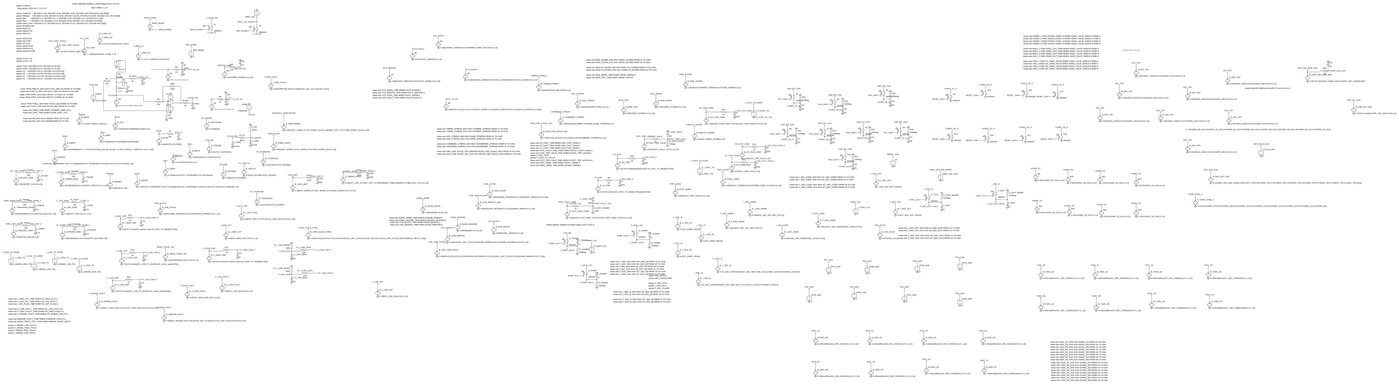
[diagram p0: schematic Draft11.asc, whole sheet]
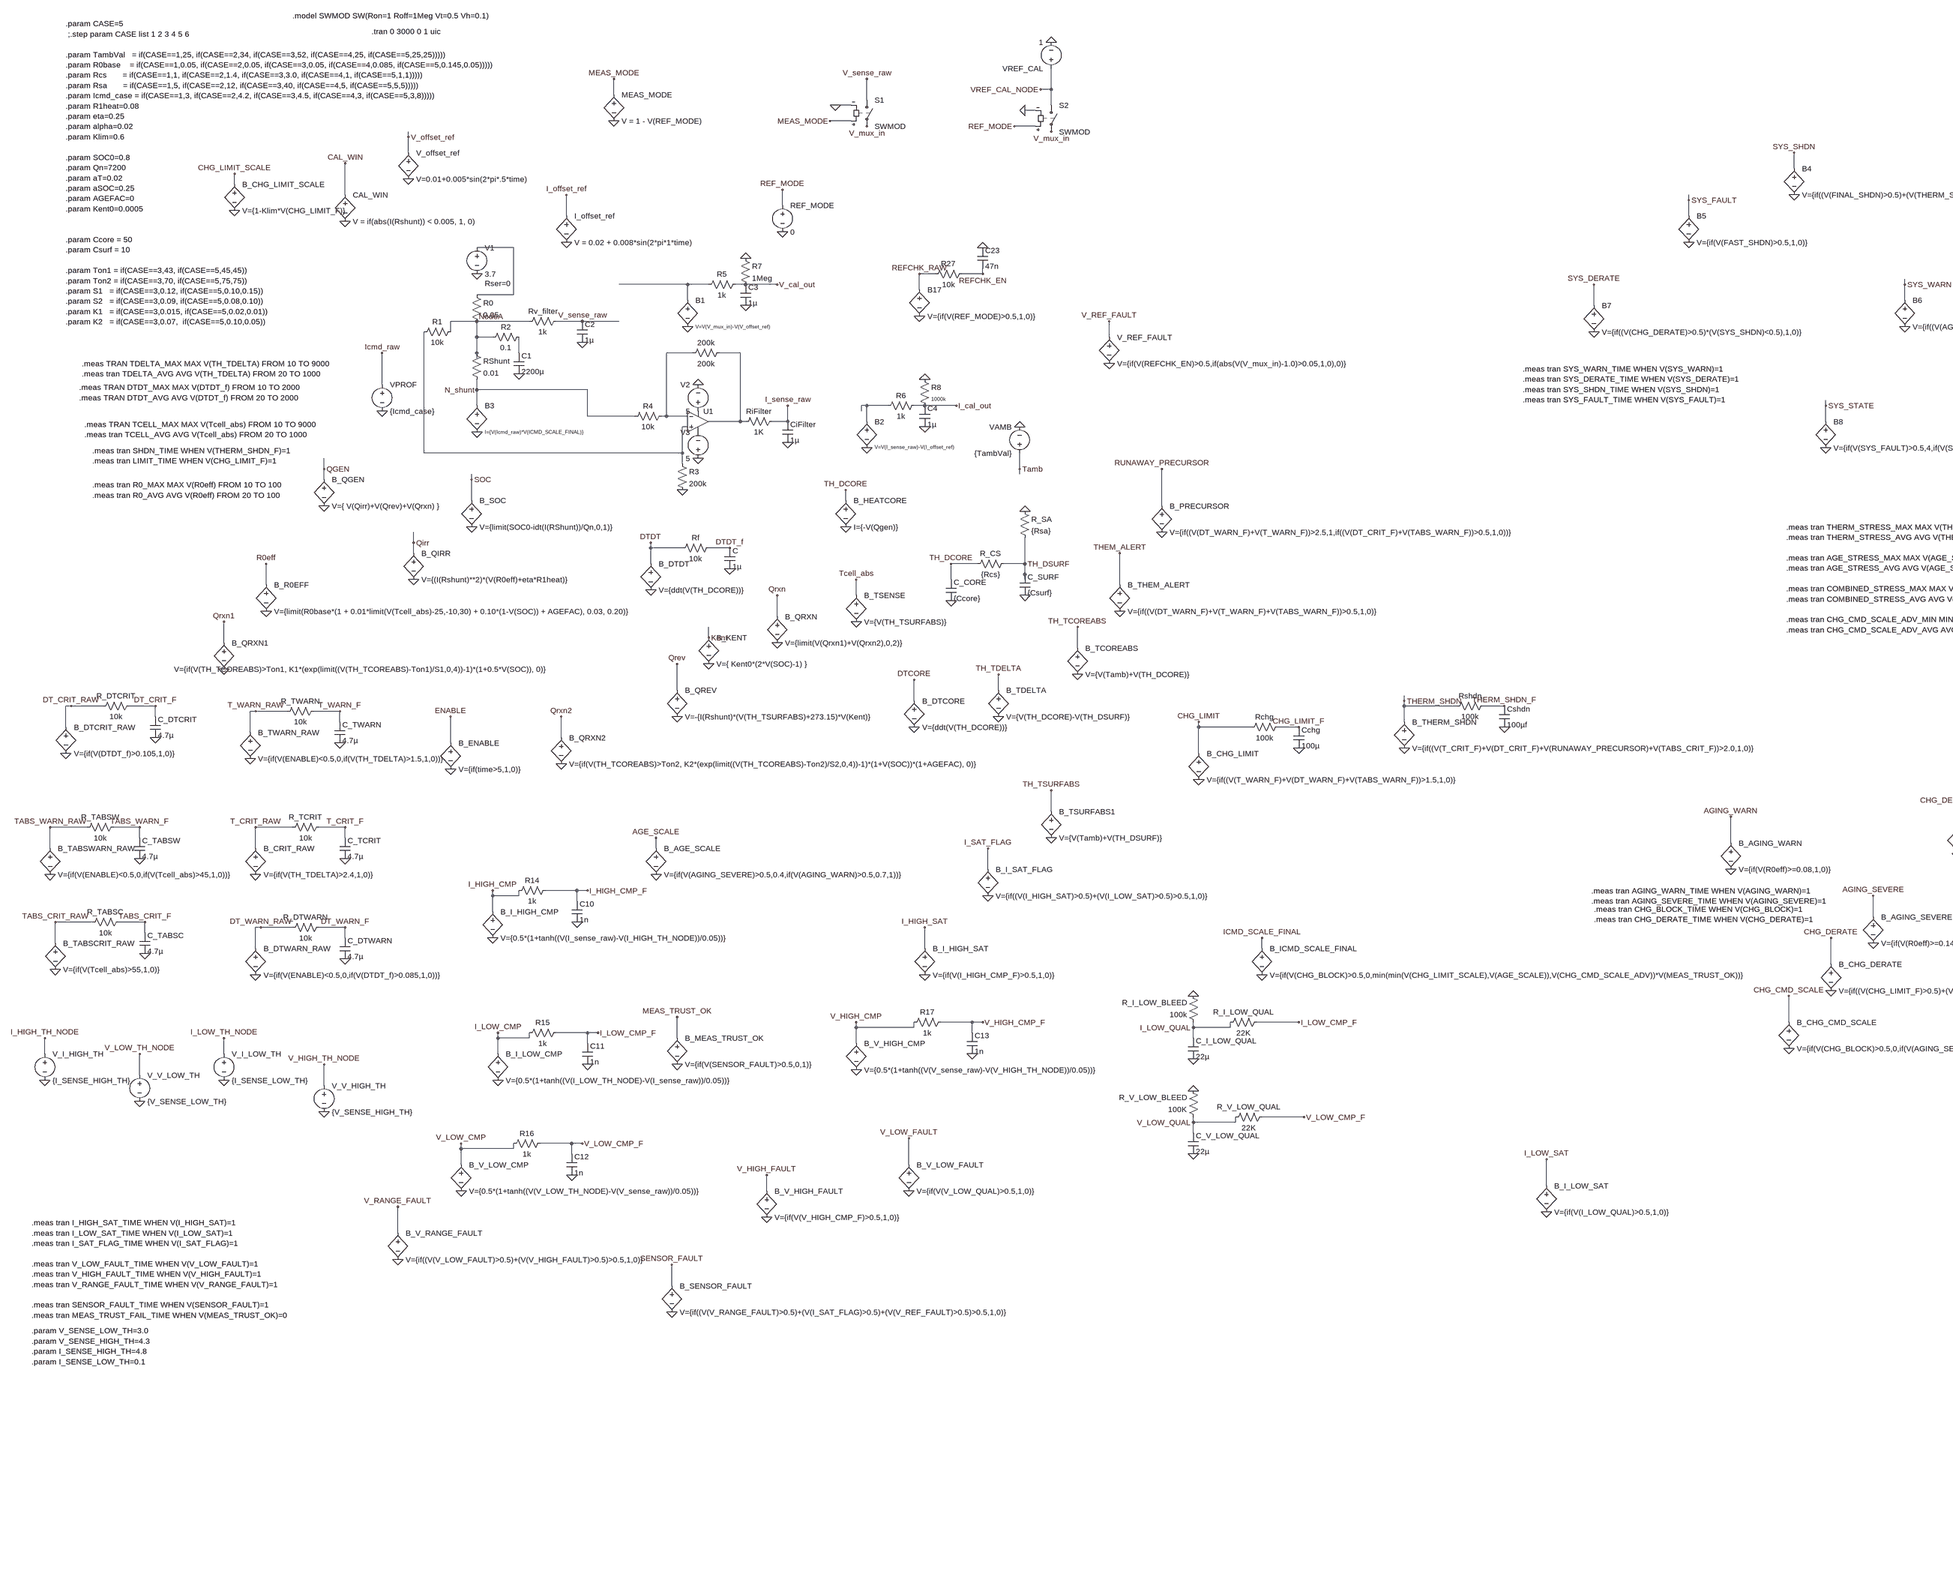
[diagram p1: schematic Draft11.asc, part, row 1 of 1, column 1 of 3]
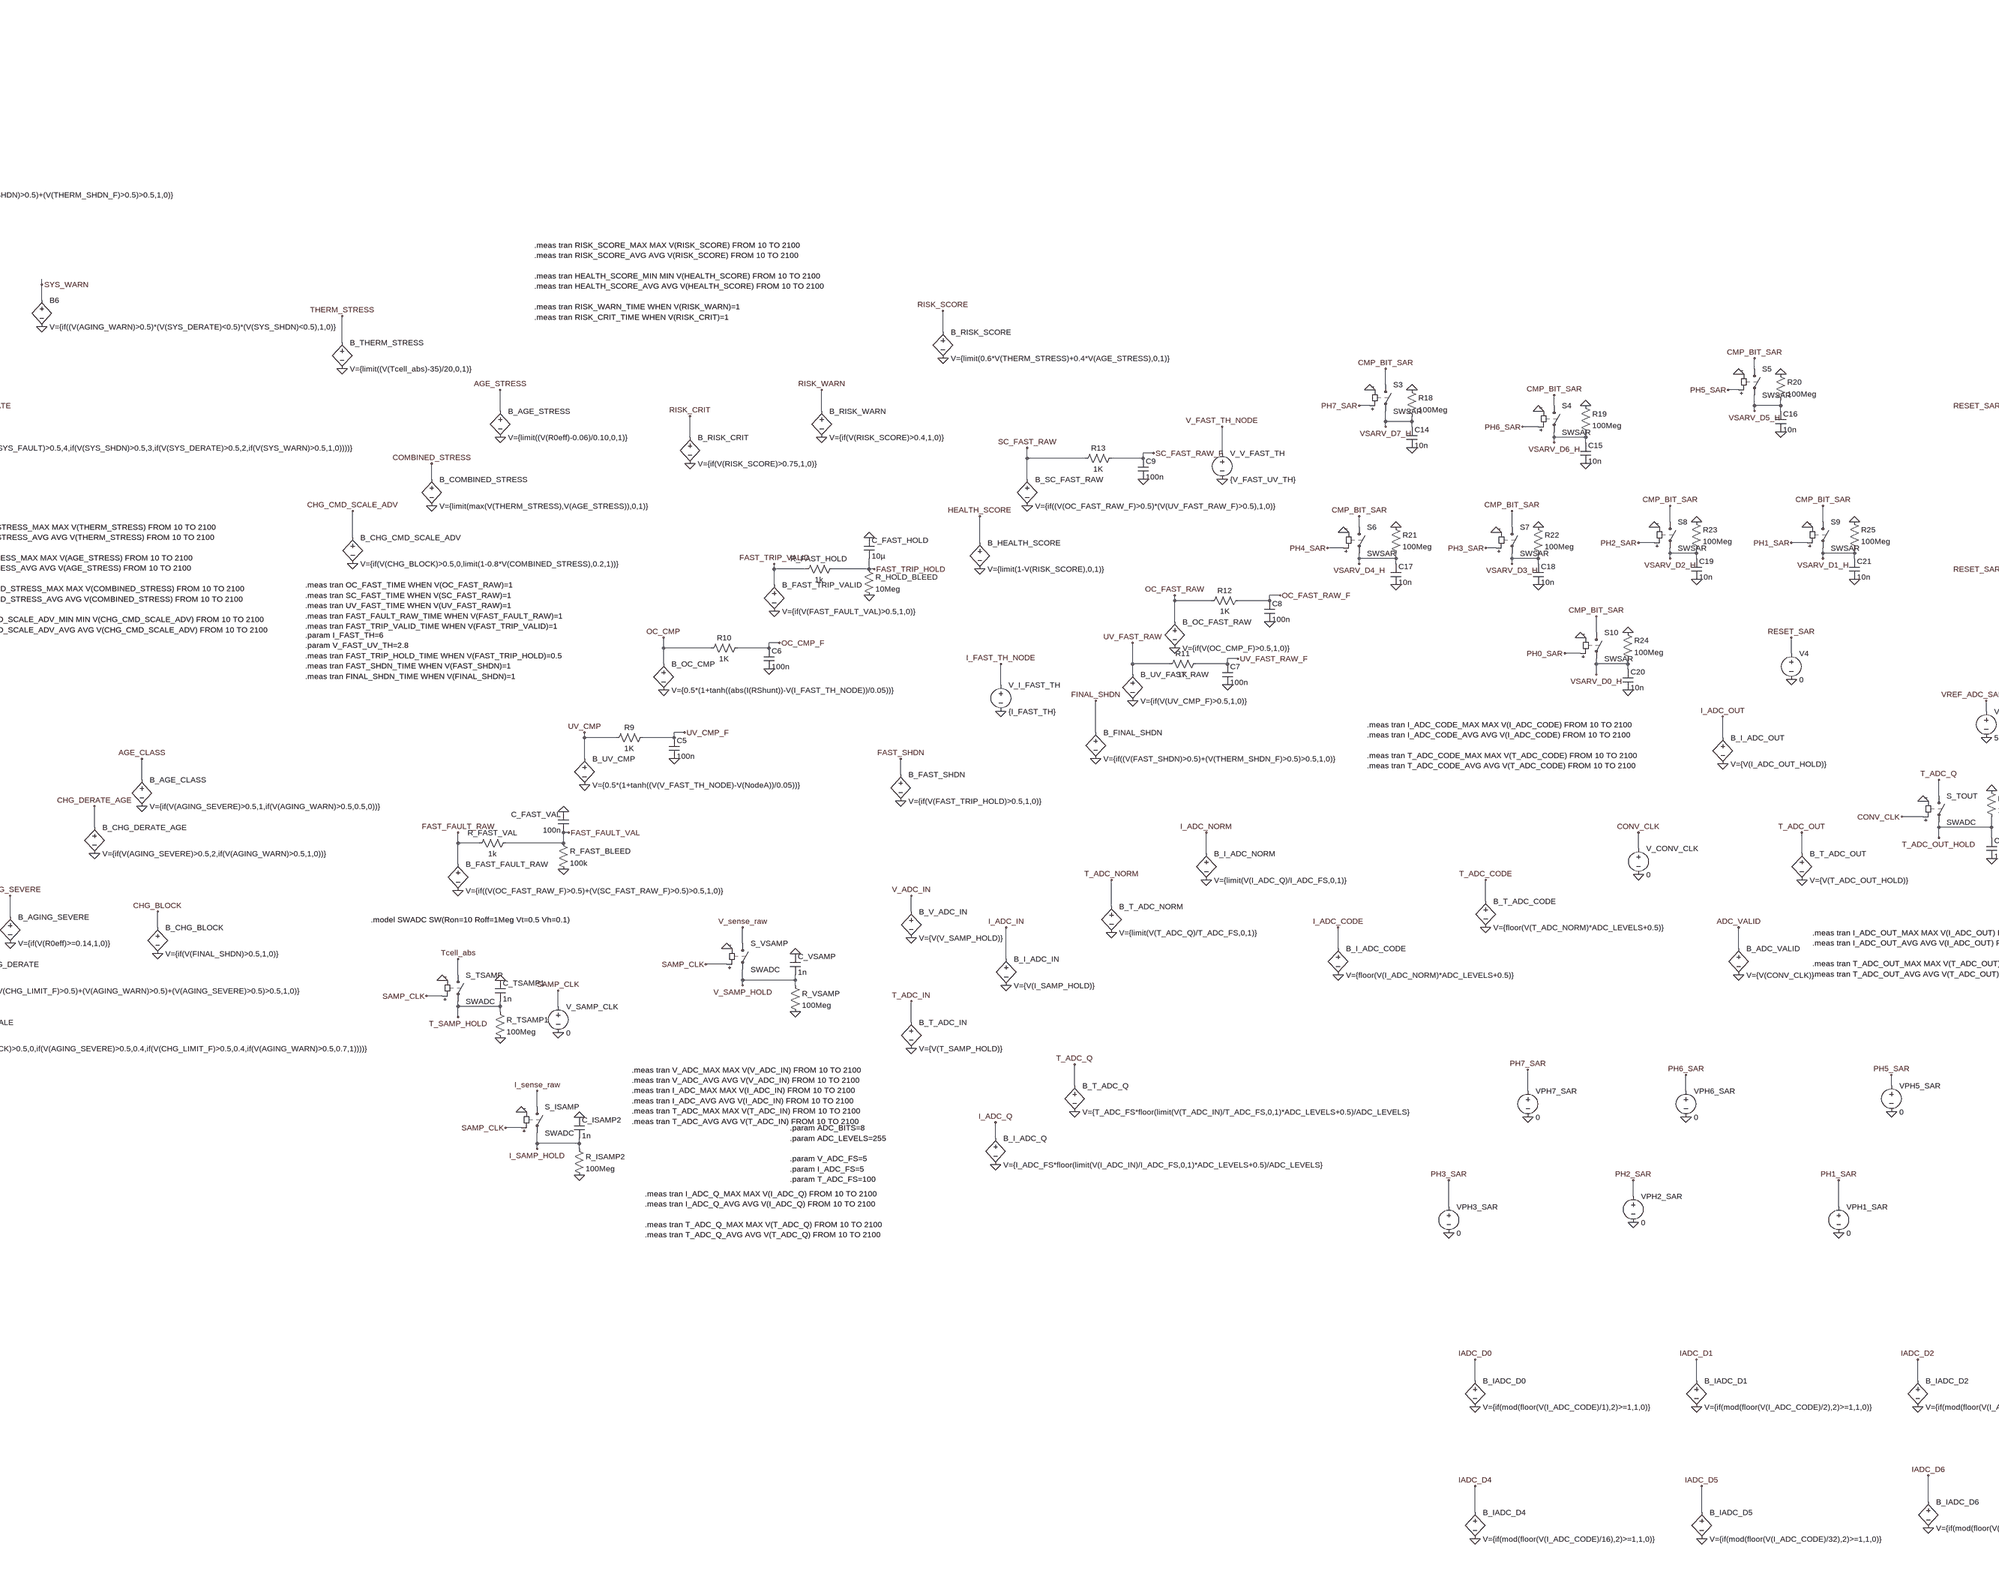
[diagram p2: schematic Draft11.asc, part, row 1 of 1, column 2 of 3]
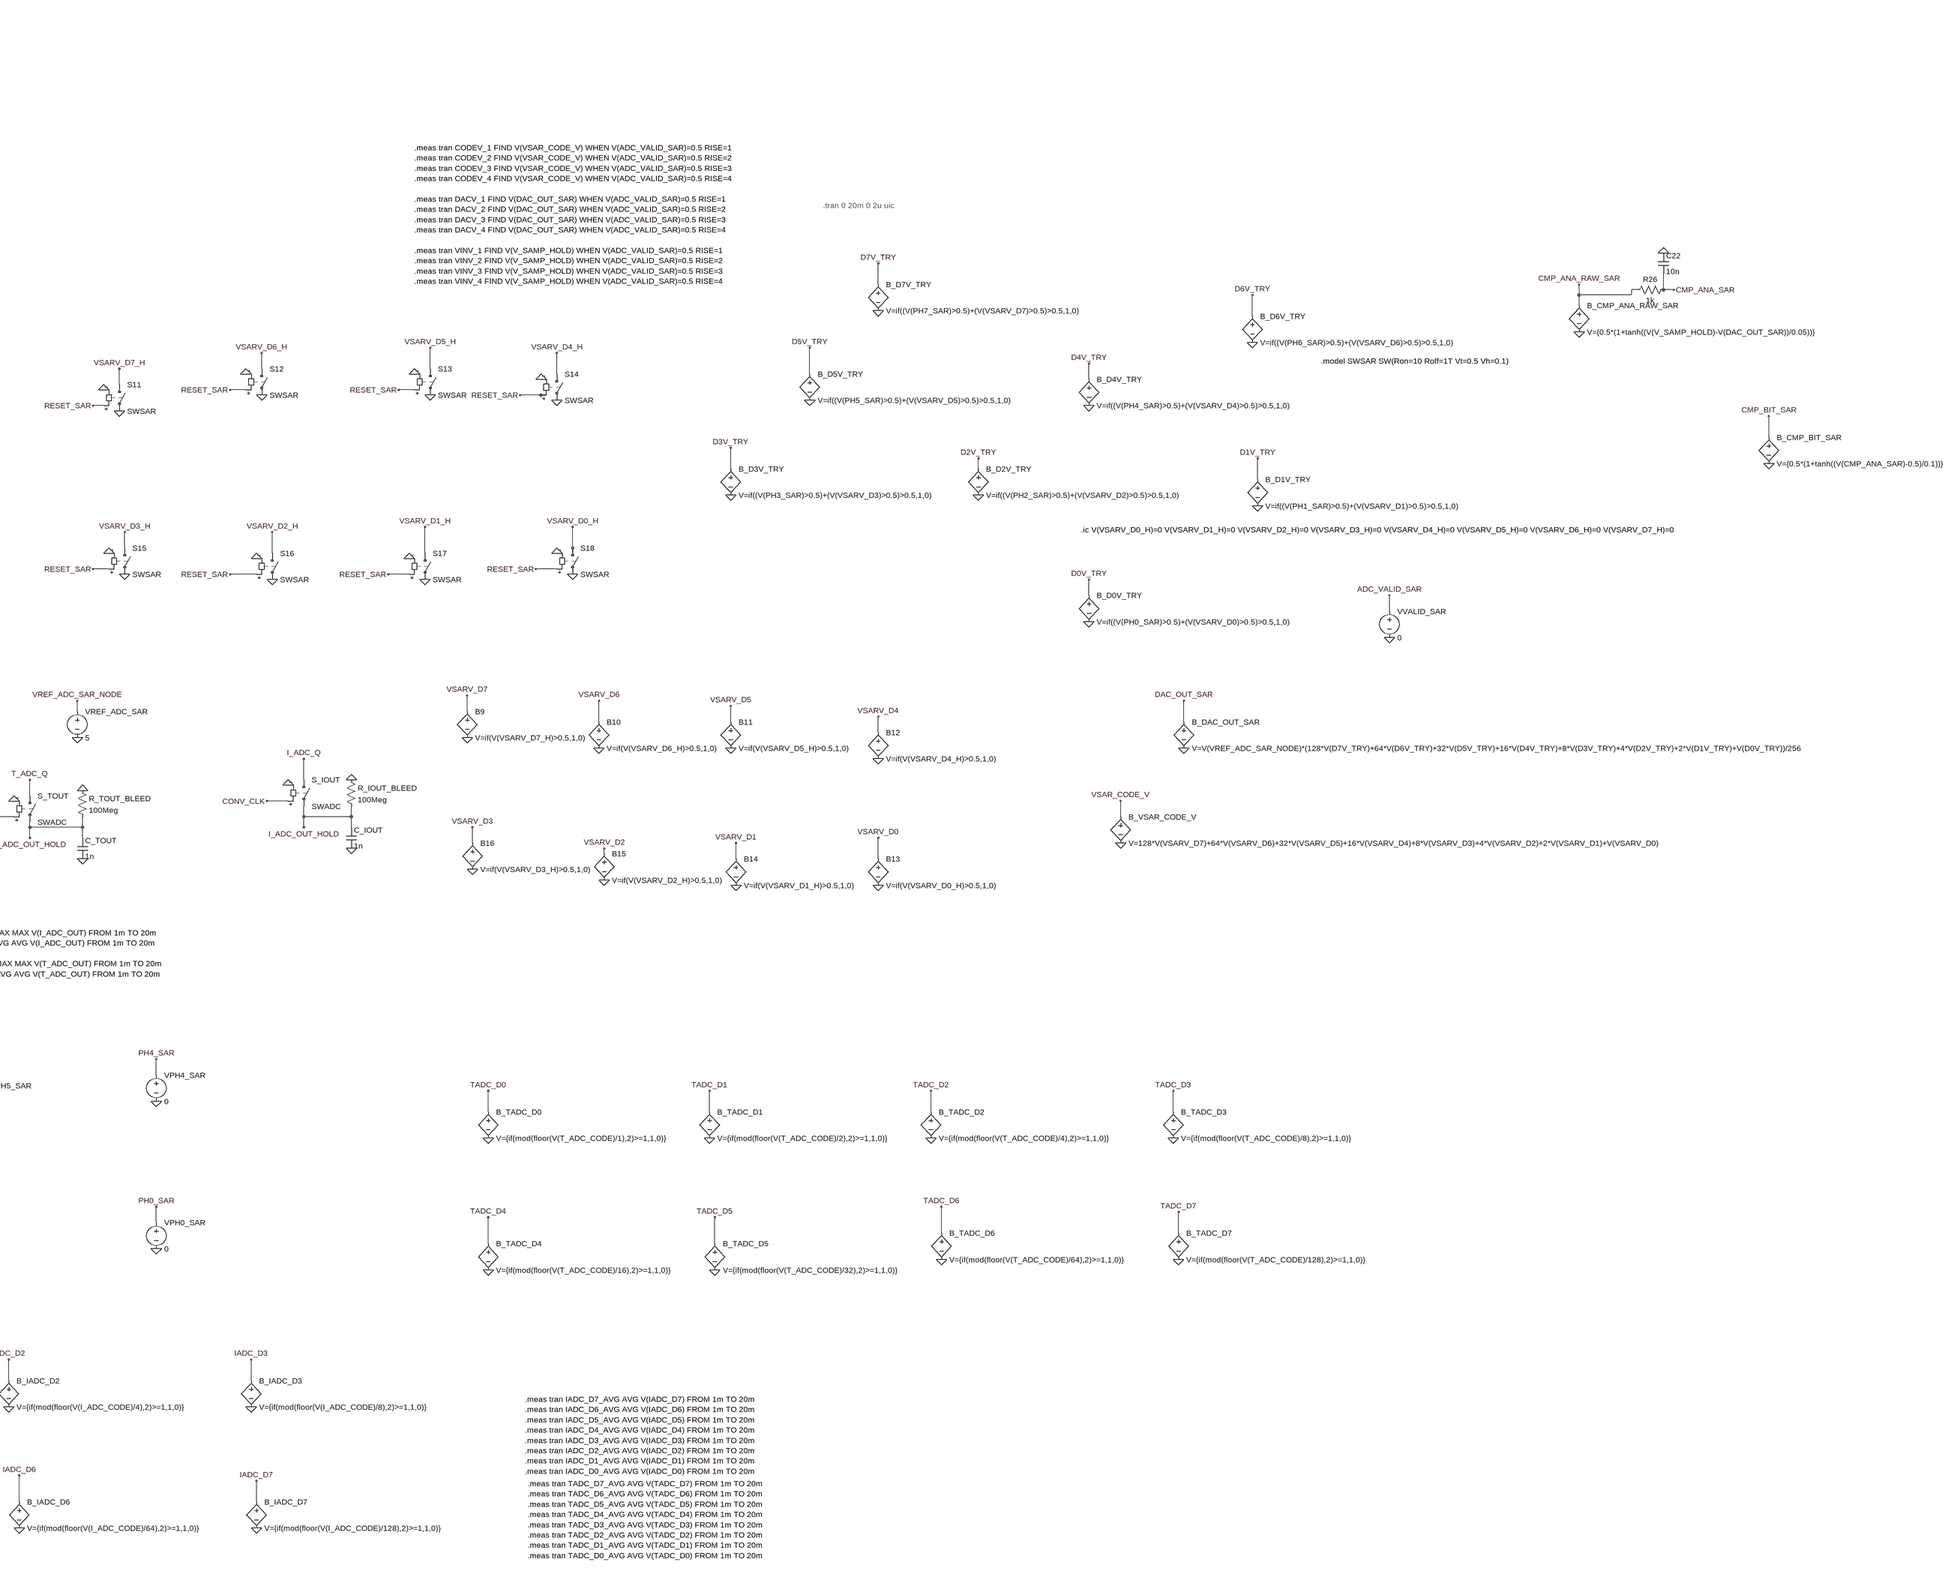
[diagram p3: schematic Draft11.asc, part, row 1 of 1, column 3 of 3]
* Draft11.asc
V1 N001 0 3.7 Rser=0
R0 N001 NodeA 0.05
R2 N003 NodeA 0.1
C1 N003 0 2200µ
Rv_filter V_sense_raw NodeA 1k
C2 V_sense_raw 0 1µ
RShunt NodeA N_shunt 0.01
RiFilter I_sense_raw N005 1K
CiFilter I_sense_raw 0 1µ
R1 NodeA N007 10k
R3 N007 0 200k
R4 N004 N_shunt 10k
R§200k N005 N004 200k
X§U1 N007 N004 P001 P002 N005 level2 Avol=1Meg GBW=10Meg Slew=10Meg Ilimit=25m Rail=0 Vos=0 En=0 Enk=0 In=0 Ink=0 Rin=500Meg  ; pins In+ In- V+ V- OUT
V2 P001 0 5
V3 0 P002 5
B1 N002 0 V=V(V_mux_in)-V(V_offset_ref)
B2 N006 0 V=V(I_sense_raw)-V(I_offset_ref)
R5 V_cal_out N002 1k
C3 V_cal_out 0 1µ
R6 I_cal_out N006 1k
C4 I_cal_out 0 1µ
R7 0 V_cal_out 1Meg
R8 0 I_cal_out 1000k
VREF_CAL VREF_CAL_NODE 0 1
B§V_offset_ref V_offset_ref 0 V=0.01+0.005*sin(2*pi*.5*time)
B§I_offset_ref I_offset_ref 0 V = 0.02 + 0.008*sin(2*pi*1*time)
B§CAL_WIN CAL_WIN 0 V = if(abs(I(Rshunt)) < 0.005, 1, 0)
V§REF_MODE REF_MODE 0 0
S1 V_sense_raw V_mux_in MEAS_MODE 0 SWMOD
S2 VREF_CAL_NODE V_mux_in REF_MODE 0 SWMOD
B§MEAS_MODE MEAS_MODE 0 V = 1 - V(REF_MODE)
B§V_REF_FAULT V_REF_FAULT 0 V={if(V(REFCHK_EN)>0.5,if(abs(V(V_mux_in)-1.0)>0.05,1,0),0)}
VAMB Tamb 0 {TambVal}
B_DTDT DTDT 0 V={ddt(V(TH_DCORE))}
Rf DTDT_f DTDT 10k
C DTDT_f 0 1µ
B_THEM_ALERT THEM_ALERT 0 V={if((V(DT_WARN_F)+V(T_WARN_F)+V(TABS_WARN_F))>0.5,1,0)}
B_PRECURSOR RUNAWAY_PRECURSOR 0 V={if((V(DT_WARN_F)+V(T_WARN_F))>2.5,1,if((V(DT_CRIT_F)+V(TABS_WARN_F))>0.5,1,0))}
B_THERM_SHDN THERM_SHDN 0 V={if((V(T_CRIT_F)+V(DT_CRIT_F)+V(RUNAWAY_PRECURSOR)+V(TABS_CRIT_F))>2.0,1,0)}
B_CHG_LIMIT CHG_LIMIT 0 V={if((V(T_WARN_F)+V(DT_WARN_F)+V(TABS_WARN_F))>1.5,1,0)}
VPROF Icmd_raw 0 {Icmd_case}
B3 N_shunt 0 I={V(Icmd_raw)*V(ICMD_SCALE_FINAL)}
Rchg CHG_LIMIT_F CHG_LIMIT 100k
Cchg CHG_LIMIT_F 0 100µ
Rshdn THERM_SHDN_F THERM_SHDN 100k
Cshdn THERM_SHDN_F 0 100µf
B_SOC SOC 0 V={limit(SOC0-idt(I(RShunt))/Qn,0,1)}
B_R0EFF R0eff 0 V={limit(R0base*(1 + 0.01*limit(V(Tcell_abs)-25,-10,30) + 0.10*(1-V(SOC)) + AGEFAC), 0.03, 0.20)}
B_QIRR Qirr 0 V={(I(Rshunt)**2)*(V(R0eff)+eta*R1heat)}
B_KENT Kent 0 V={ Kent0*(2*V(SOC)-1) }
B_QREV Qrev 0 V=-{I(Rshunt)*(V(TH_TSURFABS)+273.15)*V(Kent)}
B_QRXN Qrxn 0 V={limit(V(Qrxn1)+V(Qrxn2),0,2)}
B_QGEN QGEN 0 V={ V(Qirr)+V(Qrev)+V(Qrxn) }
R_CS TH_DSURF TH_DCORE {Rcs}
C_SURF TH_DSURF 0 {Csurf}
C_CORE TH_DCORE 0 {Ccore}
R_SA 0 TH_DSURF {Rsa}
B_HEATCORE TH_DCORE 0 I={-V(Qgen)}
B_TSENSE Tcell_abs 0 V={V(TH_TSURFABS)}
B_TDELTA TH_TDELTA 0 V={V(TH_DCORE)-V(TH_DSURF)}
B_DTCORE DTCORE 0 V={ddt(V(TH_DCORE))}
B_QRXN1 Qrxn1 0 V={if(V(TH_TCOREABS)>Ton1, K1*(exp(limit((V(TH_TCOREABS)-Ton1)/S1,0,4))-1)*(1+0.5*V(SOC)), 0)}
B_QRXN2 Qrxn2 0 V={if(V(TH_TCOREABS)>Ton2, K2*(exp(limit((V(TH_TCOREABS)-Ton2)/S2,0,4))-1)*(1+V(SOC))*(1+AGEFAC), 0)}
B_TCOREABS TH_TCOREABS 0 V={V(Tamb)+V(TH_DCORE)}
B_TSURFABS1 TH_TSURFABS 0 V={V(Tamb)+V(TH_DSURF)}
B_ENABLE ENABLE 0 V={if(time>5,1,0)}
B_TWARN_RAW T_WARN_RAW 0 V={if(V(ENABLE)<0.5,0,if(V(TH_TDELTA)>1.5,1,0))}
R_TWARN T_WARN_F T_WARN_RAW 10k
B_CRIT_RAW T_CRIT_RAW 0 V={if(V(TH_TDELTA)>2.4,1,0)}
R_TCRIT T_CRIT_F T_CRIT_RAW 10k
C_TCRIT T_CRIT_F 0 4.7µ
B_DTWARN_RAW DT_WARN_RAW 0 V={if(V(ENABLE)<0.5,0,if(V(DTDT_f)>0.085,1,0))}
R_DTWARN DT_WARN_F DT_WARN_RAW 10k
B_DTCRIT_RAW DT_CRIT_RAW 0 V={if(V(DTDT_f)>0.105,1,0)}
R_DTCRIT DT_CRIT_F DT_CRIT_RAW 10k
B_TABSWARN_RAW TABS_WARN_RAW 0 V={if(V(ENABLE)<0.5,0,if(V(Tcell_abs)>45,1,0))}
R_TABSW TABS_WARN_F TABS_WARN_RAW 10k
B_TABSCRIT_RAW TABS_CRIT_RAW 0 V={if(V(Tcell_abs)>55,1,0)}
R_TABSC TABS_CRIT_F TABS_CRIT_RAW 10k
C_TWARN T_WARN_F 0 4.7µ
C_DTCRIT DT_CRIT_F 0 4.7µ
C_TABSW TABS_WARN_F 0 4.7µ
C_TABSC TABS_CRIT_F 0 4.7µ
C_DTWARN DT_WARN_F 0 4.7µ
B_AGE_CLASS AGE_CLASS 0 V={if(V(AGING_SEVERE)>0.5,1,if(V(AGING_WARN)>0.5,0.5,0))}
B_CHG_DERATE_AGE CHG_DERATE_AGE 0 V={if(V(AGING_SEVERE)>0.5,2,if(V(AGING_WARN)>0.5,1,0))}
B_AGING_WARN AGING_WARN 0 V={if(V(R0eff)>=0.08,1,0)}
B_AGING_SEVERE AGING_SEVERE 0 V={if(V(R0eff)>=0.14,1,0)}
B_CHG_DERATE CHG_DERATE 0 V={if((V(CHG_LIMIT_F)>0.5)+(V(AGING_WARN)>0.5)+(V(AGING_SEVERE)>0.5)>0.5,1,0)}
B_CHG_BLOCK CHG_BLOCK 0 V={if(V(FINAL_SHDN)>0.5,1,0)}
B_CHG_CMD_SCALE CHG_CMD_SCALE 0 V={if(V(CHG_BLOCK)>0.5,0,if(V(AGING_SEVERE)>0.5,0.4,if(V(CHG_LIMIT_F)>0.5,0.4,if(V(AGING_WARN)>0.5,0.7,1))))}
B4 SYS_SHDN 0 V={if((V(FINAL_SHDN)>0.5)+(V(THERM_SHDN_F)>0.5)>0.5,1,0)}
B5 SYS_FAULT 0 V={if(V(FAST_SHDN)>0.5,1,0)}
B6 SYS_WARN 0 V={if((V(AGING_WARN)>0.5)*(V(SYS_DERATE)<0.5)*(V(SYS_SHDN)<0.5),1,0)}
B7 SYS_DERATE 0 V={if((V(CHG_DERATE)>0.5)*(V(SYS_SHDN)<0.5),1,0)}
B8 SYS_STATE 0 V={if(V(SYS_FAULT)>0.5,4,if(V(SYS_SHDN)>0.5,3,if(V(SYS_DERATE)>0.5,2,if(V(SYS_WARN)>0.5,1,0))))}
B_AGE_STRESS AGE_STRESS 0 V={limit((V(R0eff)-0.06)/0.10,0,1)}
B_COMBINED_STRESS COMBINED_STRESS 0 V={limit(max(V(THERM_STRESS),V(AGE_STRESS)),0,1)}
B_CHG_CMD_SCALE_ADV CHG_CMD_SCALE_ADV 0 V={if(V(CHG_BLOCK)>0.5,0,limit(1-0.8*V(COMBINED_STRESS),0.2,1))}
B_THERM_STRESS THERM_STRESS 0 V={limit((V(Tcell_abs)-35)/20,0,1)}
B_RISK_SCORE RISK_SCORE 0 V={limit(0.6*V(THERM_STRESS)+0.4*V(AGE_STRESS),0,1)}
B_RISK_WARN RISK_WARN 0 V={if(V(RISK_SCORE)>0.4,1,0)}
B_RISK_CRIT RISK_CRIT 0 V={if(V(RISK_SCORE)>0.75,1,0)}
B_HEALTH_SCORE HEALTH_SCORE 0 V={limit(1-V(RISK_SCORE),0,1)}
B_OC_CMP OC_CMP 0 V={0.5*(1+tanh((abs(I(RShunt))-V(I_FAST_TH_NODE))/0.05))}
B_UV_CMP UV_CMP 0 V={0.5*(1+tanh((V(V_FAST_TH_NODE)-V(NodeA))/0.05))}
B_OC_FAST_RAW OC_FAST_RAW 0 V={if(V(OC_CMP_F)>0.5,1,0)}
B_UV_FAST_RAW UV_FAST_RAW 0 V={if(V(UV_CMP_F)>0.5,1,0)}
B_SC_FAST_RAW SC_FAST_RAW 0 V={if((V(OC_FAST_RAW_F)>0.5)*(V(UV_FAST_RAW_F)>0.5),1,0)}
B_FAST_FAULT_RAW FAST_FAULT_RAW 0 V={if((V(OC_FAST_RAW_F)>0.5)+(V(SC_FAST_RAW_F)>0.5)>0.5,1,0)}
B_FINAL_SHDN FINAL_SHDN 0 V={if((V(FAST_SHDN)>0.5)+(V(THERM_SHDN_F)>0.5)>0.5,1,0)}
R_FAST_VAL FAST_FAULT_VAL FAST_FAULT_RAW 1k
C_FAST_VAL FAST_FAULT_VAL 0 100n
R_FAST_BLEED FAST_FAULT_VAL 0 100k
B_FAST_TRIP_VALID FAST_TRIP_VALID 0 V={if(V(FAST_FAULT_VAL)>0.5,1,0)}
R_FAST_HOLD FAST_TRIP_HOLD FAST_TRIP_VALID 1k
C_FAST_HOLD 0 FAST_TRIP_HOLD 10µ
R_HOLD_BLEED FAST_TRIP_HOLD 0 10Meg
B_FAST_SHDN FAST_SHDN 0 V={if(V(FAST_TRIP_HOLD)>0.5,1,0)}
V_I_FAST_TH I_FAST_TH_NODE 0 {I_FAST_TH}
V_V_FAST_TH V_FAST_TH_NODE 0 {V_FAST_UV_TH}
R9 UV_CMP_F UV_CMP 1K
C5 UV_CMP_F 0 100n
R10 OC_CMP_F OC_CMP 1K
C6 OC_CMP_F 0 100n
R11 UV_FAST_RAW_F UV_FAST_RAW 1K
C7 UV_FAST_RAW_F 0 100n
R12 OC_FAST_RAW_F OC_FAST_RAW 1K
C8 OC_FAST_RAW_F 0 100n
R13 SC_FAST_RAW_F SC_FAST_RAW 1K
C9 SC_FAST_RAW_F 0 100n
B_I_HIGH_CMP I_HIGH_CMP 0 V={0.5*(1+tanh((V(I_sense_raw)-V(I_HIGH_TH_NODE))/0.05))}
B_I_HIGH_SAT I_HIGH_SAT 0 V={if(V(I_HIGH_CMP_F)>0.5,1,0)}
B_I_SAT_FLAG I_SAT_FLAG 0 V={if((V(I_HIGH_SAT)>0.5)+(V(I_LOW_SAT)>0.5)>0.5,1,0)}
B_I_LOW_CMP I_LOW_CMP 0 V={0.5*(1+tanh((V(I_LOW_TH_NODE)-V(I_sense_raw))/0.05))}
B_V_HIGH_CMP V_HIGH_CMP 0 V={0.5*(1+tanh((V(V_sense_raw)-V(V_HIGH_TH_NODE))/0.05))}
B_V_LOW_CMP V_LOW_CMP 0 V={0.5*(1+tanh((V(V_LOW_TH_NODE)-V(V_sense_raw))/0.05))}
B_V_HIGH_FAULT V_HIGH_FAULT 0 V={if(V(V_HIGH_CMP_F)>0.5,1,0)}
R14 I_HIGH_CMP_F I_HIGH_CMP 1k
C10 I_HIGH_CMP_F 0 1n
R15 I_LOW_CMP_F I_LOW_CMP 1k
C11 I_LOW_CMP_F 0 1n
R16 V_LOW_CMP_F V_LOW_CMP 1k
C12 V_LOW_CMP_F 0 1n
R17 V_HIGH_CMP_F V_HIGH_CMP 1k
C13 V_HIGH_CMP_F 0 1n
B_V_RANGE_FAULT V_RANGE_FAULT 0 V={if((V(V_LOW_FAULT)>0.5)+(V(V_HIGH_FAULT)>0.5)>0.5,1,0)}
B_SENSOR_FAULT SENSOR_FAULT 0 V={if((V(V_RANGE_FAULT)>0.5)+(V(I_SAT_FLAG)>0.5)+(V(V_REF_FAULT)>0.5)>0.5,1,0)}
B_MEAS_TRUST_OK MEAS_TRUST_OK 0 V={if(V(SENSOR_FAULT)>0.5,0,1)}
V_I_HIGH_TH I_HIGH_TH_NODE 0 {I_SENSE_HIGH_TH}
V_I_LOW_TH I_LOW_TH_NODE 0 {I_SENSE_LOW_TH}
V_V_LOW_TH V_LOW_TH_NODE 0 {V_SENSE_LOW_TH}
V_V_HIGH_TH V_HIGH_TH_NODE 0 {V_SENSE_HIGH_TH}
R_I_LOW_QUAL I_LOW_CMP_F I_LOW_QUAL 22K
C_I_LOW_QUAL I_LOW_QUAL 0 22µ
R_V_LOW_QUAL V_LOW_CMP_F V_LOW_QUAL 22K
C_V_LOW_QUAL V_LOW_QUAL 0 22µ
R_V_LOW_BLEED V_LOW_QUAL 0 100K
R_I_LOW_BLEED I_LOW_QUAL 0 100k
B_V_LOW_FAULT V_LOW_FAULT 0 V={if(V(V_LOW_QUAL)>0.5,1,0)}
B_I_LOW_SAT I_LOW_SAT 0 V={if(V(I_LOW_QUAL)>0.5,1,0)}
V_SAMP_CLK SAMP_CLK 0 0
S_VSAMP V_sense_raw V_SAMP_HOLD SAMP_CLK 0 SWADC
S_TSAMP Tcell_abs T_SAMP_HOLD SAMP_CLK 0 SWADC
S_ISAMP I_sense_raw I_SAMP_HOLD SAMP_CLK 0 SWADC
R_VSAMP V_SAMP_HOLD 0 100Meg
C_VSAMP 0 V_SAMP_HOLD 1n
R_TSAMP1 T_SAMP_HOLD 0 100Meg
C_TSAMP1 0 T_SAMP_HOLD 1n
R_ISAMP2 I_SAMP_HOLD 0 100Meg
C_ISAMP2 0 I_SAMP_HOLD 1n
B_V_ADC_IN V_ADC_IN 0 V={V(V_SAMP_HOLD)}
B_I_ADC_IN I_ADC_IN 0 V={V(I_SAMP_HOLD)}
B_T_ADC_IN T_ADC_IN 0 V={V(T_SAMP_HOLD)}
B_T_ADC_Q T_ADC_Q 0 V={T_ADC_FS*floor(limit(V(T_ADC_IN)/T_ADC_FS,0,1)*ADC_LEVELS+0.5)/ADC_LEVELS}
B_I_ADC_Q I_ADC_Q 0 V={I_ADC_FS*floor(limit(V(I_ADC_IN)/I_ADC_FS,0,1)*ADC_LEVELS+0.5)/ADC_LEVELS}
B_I_ADC_NORM I_ADC_NORM 0 V={limit(V(I_ADC_Q)/I_ADC_FS,0,1)}
B_T_ADC_NORM T_ADC_NORM 0 V={limit(V(T_ADC_Q)/T_ADC_FS,0,1)}
B_I_ADC_CODE I_ADC_CODE 0 V={floor(V(I_ADC_NORM)*ADC_LEVELS+0.5)}
B_T_ADC_CODE T_ADC_CODE 0 V={floor(V(T_ADC_NORM)*ADC_LEVELS+0.5)}
V_CONV_CLK CONV_CLK 0 0
B_I_ADC_OUT I_ADC_OUT 0 V={V(I_ADC_OUT_HOLD)}
B_T_ADC_OUT T_ADC_OUT 0 V={V(T_ADC_OUT_HOLD)}
B_ADC_VALID ADC_VALID 0 V={V(CONV_CLK)}
S_TOUT T_ADC_Q T_ADC_OUT_HOLD CONV_CLK 0 SWADC
S_IOUT I_ADC_Q I_ADC_OUT_HOLD CONV_CLK 0 SWADC
R_TOUT_BLEED 0 T_ADC_OUT_HOLD 100Meg
C_TOUT T_ADC_OUT_HOLD 0 1n
R_IOUT_BLEED 0 I_ADC_OUT_HOLD 100Meg
C_IOUT I_ADC_OUT_HOLD 0 1n
B_IADC_D0 IADC_D0 0 V={if(mod(floor(V(I_ADC_CODE)/1),2)>=1,1,0)}
B_IADC_D1 IADC_D1 0 V={if(mod(floor(V(I_ADC_CODE)/2),2)>=1,1,0)}
B_IADC_D2 IADC_D2 0 V={if(mod(floor(V(I_ADC_CODE)/4),2)>=1,1,0)}
B_IADC_D3 IADC_D3 0 V={if(mod(floor(V(I_ADC_CODE)/8),2)>=1,1,0)}
B_IADC_D4 IADC_D4 0 V={if(mod(floor(V(I_ADC_CODE)/16),2)>=1,1,0)}
B_IADC_D5 IADC_D5 0 V={if(mod(floor(V(I_ADC_CODE)/32),2)>=1,1,0)}
B_IADC_D6 IADC_D6 0 V={if(mod(floor(V(I_ADC_CODE)/64),2)>=1,1,0)}
B_IADC_D7 IADC_D7 0 V={if(mod(floor(V(I_ADC_CODE)/128),2)>=1,1,0)}
B_TADC_D0 TADC_D0 0 V={if(mod(floor(V(T_ADC_CODE)/1),2)>=1,1,0)}
B_TADC_D1 TADC_D1 0 V={if(mod(floor(V(T_ADC_CODE)/2),2)>=1,1,0)}
B_TADC_D2 TADC_D2 0 V={if(mod(floor(V(T_ADC_CODE)/4),2)>=1,1,0)}
B_TADC_D3 TADC_D3 0 V={if(mod(floor(V(T_ADC_CODE)/8),2)>=1,1,0)}
B_TADC_D4 TADC_D4 0 V={if(mod(floor(V(T_ADC_CODE)/16),2)>=1,1,0)}
B_TADC_D5 TADC_D5 0 V={if(mod(floor(V(T_ADC_CODE)/32),2)>=1,1,0)}
B_TADC_D6 TADC_D6 0 V={if(mod(floor(V(T_ADC_CODE)/64),2)>=1,1,0)}
B_TADC_D7 TADC_D7 0 V={if(mod(floor(V(T_ADC_CODE)/128),2)>=1,1,0)}
S3 CMP_BIT_SAR VSARV_D7_H PH7_SAR 0 SWSAR
S4 CMP_BIT_SAR VSARV_D6_H PH6_SAR 0 SWSAR
S5 CMP_BIT_SAR VSARV_D5_H PH5_SAR 0 SWSAR
S6 CMP_BIT_SAR VSARV_D4_H PH4_SAR 0 SWSAR
S7 CMP_BIT_SAR VSARV_D3_H PH3_SAR 0 SWSAR
S8 CMP_BIT_SAR VSARV_D2_H PH2_SAR 0 SWSAR
S9 CMP_BIT_SAR VSARV_D1_H PH1_SAR 0 SWSAR
S10 CMP_BIT_SAR VSARV_D0_H PH0_SAR 0 SWSAR
R18 0 VSARV_D7_H 100Meg
C14 VSARV_D7_H 0 10n
R19 0 VSARV_D6_H 100Meg
C15 VSARV_D6_H 0 10n
R20 0 VSARV_D5_H 100Meg
C16 VSARV_D5_H 0 10n
R21 0 VSARV_D4_H 100Meg
C17 VSARV_D4_H 0 10n
R22 0 VSARV_D3_H 100Meg
C18 VSARV_D3_H 0 10n
R23 0 VSARV_D2_H 100Meg
C19 VSARV_D2_H 0 10n
R24 0 VSARV_D0_H 100Meg
C20 VSARV_D0_H 0 10n
R25 0 VSARV_D1_H 100Meg
C21 VSARV_D1_H 0 10n
S11 VSARV_D7_H 0 RESET_SAR 0 SWSAR
S12 VSARV_D6_H 0 RESET_SAR 0 SWSAR
S13 VSARV_D5_H 0 RESET_SAR 0 SWSAR
S14 VSARV_D4_H 0 RESET_SAR 0 SWSAR
S15 VSARV_D3_H 0 RESET_SAR 0 SWSAR
S16 VSARV_D2_H 0 RESET_SAR 0 SWSAR
S17 VSARV_D1_H 0 RESET_SAR 0 SWSAR
S18 VSARV_D0_H 0 RESET_SAR 0 SWSAR
V4 RESET_SAR 0 0
B9 VSARV_D7 0 V=if(V(VSARV_D7_H)>0.5,1,0)
B10 VSARV_D6 0 V=if(V(VSARV_D6_H)>0.5,1,0)
B11 VSARV_D5 0 V=if(V(VSARV_D5_H)>0.5,1,0)
B12 VSARV_D4 0 V=if(V(VSARV_D4_H)>0.5,1,0)
B13 VSARV_D0 0 V=if(V(VSARV_D0_H)>0.5,1,0)
B14 VSARV_D1 0 V=if(V(VSARV_D1_H)>0.5,1,0)
B15 VSARV_D2 0 V=if(V(VSARV_D2_H)>0.5,1,0)
B16 VSARV_D3 0 V=if(V(VSARV_D3_H)>0.5,1,0)
B_D5V_TRY D5V_TRY 0 V=if((V(PH5_SAR)>0.5)+(V(VSARV_D5)>0.5)>0.5,1,0)
B_D7V_TRY D7V_TRY 0 V=if((V(PH7_SAR)>0.5)+(V(VSARV_D7)>0.5)>0.5,1,0)
B_D4V_TRY D4V_TRY 0 V=if((V(PH4_SAR)>0.5)+(V(VSARV_D4)>0.5)>0.5,1,0)
B_D6V_TRY D6V_TRY 0 V=if((V(PH6_SAR)>0.5)+(V(VSARV_D6)>0.5)>0.5,1,0)
B_D3V_TRY D3V_TRY 0 V=if((V(PH3_SAR)>0.5)+(V(VSARV_D3)>0.5)>0.5,1,0)
B_D2V_TRY D2V_TRY 0 V=if((V(PH2_SAR)>0.5)+(V(VSARV_D2)>0.5)>0.5,1,0)
B_D1V_TRY D1V_TRY 0 V=if((V(PH1_SAR)>0.5)+(V(VSARV_D1)>0.5)>0.5,1,0)
B_D0V_TRY D0V_TRY 0 V=if((V(PH0_SAR)>0.5)+(V(VSARV_D0)>0.5)>0.5,1,0)
B_DAC_OUT_SAR DAC_OUT_SAR 0 V=V(VREF_ADC_SAR_NODE)*(128*V(D7V_TRY)+64*V(D6V_TRY)+32*V(D5V_TRY)+16*V(D4V_TRY)+8*V(D3V_TRY)+4*V(D2V_TRY)+2*V(D1V_TRY)+V(D0V_TRY))/256
B_VSAR_CODE_V VSAR_CODE_V 0 V=128*V(VSARV_D7)+64*V(VSARV_D6)+32*V(VSARV_D5)+16*V(VSARV_D4)+8*V(VSARV_D3)+4*V(VSARV_D2)+2*V(VSARV_D1)+V(VSARV_D0)
VPH7_SAR PH7_SAR 0 0
VPH6_SAR PH6_SAR 0 0
VPH5_SAR PH5_SAR 0 0
VPH4_SAR PH4_SAR 0 0
VPH0_SAR PH0_SAR 0 0
VPH1_SAR PH1_SAR 0 0
VPH2_SAR PH2_SAR 0 0
VPH3_SAR PH3_SAR 0 0
VVALID_SAR ADC_VALID_SAR 0 0
B_CMP_ANA_RAW_SAR CMP_ANA_RAW_SAR 0 V={0.5*(1+tanh((V(V_SAMP_HOLD)-V(DAC_OUT_SAR))/0.05))}
B_CMP_BIT_SAR CMP_BIT_SAR 0 V={0.5*(1+tanh((V(CMP_ANA_SAR)-0.5)/0.1))}
R26 CMP_ANA_SAR CMP_ANA_RAW_SAR 1k
C22 0 CMP_ANA_SAR 10n
VREF_ADC_SAR VREF_ADC_SAR_NODE 0 5
B17 REFCHK_RAW 0 V={if(V(REF_MODE)>0.5,1,0)}
R27 REFCHK_EN REFCHK_RAW 10k
C23 0 REFCHK_EN 47n
B_ICMD_SCALE_FINAL ICMD_SCALE_FINAL 0 V={if(V(CHG_BLOCK)>0.5,0,min(min(V(CHG_LIMIT_SCALE),V(AGE_SCALE)),V(CHG_CMD_SCALE_ADV))*V(MEAS_TRUST_OK))}
B_CHG_LIMIT_SCALE CHG_LIMIT_SCALE 0 V={1-Klim*V(CHG_LIMIT_F)}
B_AGE_SCALE AGE_SCALE 0 V={if(V(AGING_SEVERE)>0.5,0.4,if(V(AGING_WARN)>0.5,0.7,1))}
.tran 0 3000 0 1 uic
.model SWMOD SW(Ron=1 Roff=1Meg Vt=0.5 Vh=0.1)
.param CASE=5
 ;.step param CASE list 1 2 3 4 5 6
.param TambVal   = if(CASE==1,25, if(CASE==2,34, if(CASE==3,52, if(CASE==4,25, if(CASE==5,25,25)))))
.param R0base    = if(CASE==1,0.05, if(CASE==2,0.05, if(CASE==3,0.05, if(CASE==4,0.085, if(CASE==5,0.145,0.05)))))
.param Rcs       = if(CASE==1,1, if(CASE==2,1.4, if(CASE==3,3.0, if(CASE==4,1, if(CASE==5,1,1)))))
.param Rsa       = if(CASE==1,5, if(CASE==2,12, if(CASE==3,40, if(CASE==4,5, if(CASE==5,5,5)))))
.param Icmd_case = if(CASE==1,3, if(CASE==2,4.2, if(CASE==3,4.5, if(CASE==4,3, if(CASE==5,3,8)))))
.param R1heat=0.08
.param eta=0.25
.param alpha=0.02
.param Klim=0.6
.param SOC0=0.8
.param Qn=7200
.param aT=0.02
.param aSOC=0.25
.param AGEFAC=0
.param Kent0=0.0005
.param Ccore = 50
.param Csurf = 10
.param Ton1 = if(CASE==3,43, if(CASE==5,45,45))
.param Ton2 = if(CASE==3,70, if(CASE==5,75,75))
.param S1   = if(CASE==3,0.12, if(CASE==5,0.10,0.15))
.param S2   = if(CASE==3,0.09, if(CASE==5,0.08,0.10))
.param K1   = if(CASE==3,0.015, if(CASE==5,0.02,0.01))
.param K2   = if(CASE==3,0.07,  if(CASE==5,0.10,0.05))
.meas TRAN TDELTA_MAX MAX V(TH_TDELTA) FROM 10 TO 9000
.meas tran TDELTA_AVG AVG V(TH_TDELTA) FROM 20 TO 1000
.meas TRAN DTDT_MAX MAX V(DTDT_f) FROM 10 TO 2000
.meas TRAN DTDT_AVG AVG V(DTDT_f) FROM 20 TO 2000
.meas TRAN TCELL_MAX MAX V(Tcell_abs) FROM 10 TO 9000
.meas tran TCELL_AVG AVG V(Tcell_abs) FROM 20 TO 1000
.meas tran SHDN_TIME WHEN V(THERM_SHDN_F)=1
.meas tran LIMIT_TIME WHEN V(CHG_LIMIT_F)=1
.meas tran R0_MAX MAX V(R0eff) FROM 10 TO 100
.meas tran R0_AVG AVG V(R0eff) FROM 20 TO 100
.param I_FAST_TH=6
.param V_FAST_UV_TH=2.8
.meas tran FAST_TRIP_HOLD_TIME WHEN V(FAST_TRIP_HOLD)=0.5
.meas tran FAST_SHDN_TIME WHEN V(FAST_SHDN)=1
.meas tran FINAL_SHDN_TIME WHEN V(FINAL_SHDN)=1
.meas tran OC_FAST_TIME WHEN V(OC_FAST_RAW)=1
.meas tran SC_FAST_TIME WHEN V(SC_FAST_RAW)=1
.meas tran UV_FAST_TIME WHEN V(UV_FAST_RAW)=1
.meas tran FAST_FAULT_RAW_TIME WHEN V(FAST_FAULT_RAW)=1
.meas tran FAST_TRIP_VALID_TIME WHEN V(FAST_TRIP_VALID)=1
.meas tran AGING_WARN_TIME WHEN V(AGING_WARN)=1
.meas tran AGING_SEVERE_TIME WHEN V(AGING_SEVERE)=1
.meas tran CHG_BLOCK_TIME WHEN V(CHG_BLOCK)=1
.meas tran CHG_DERATE_TIME WHEN V(CHG_DERATE)=1
.meas tran SYS_WARN_TIME WHEN V(SYS_WARN)=1
.meas tran SYS_DERATE_TIME WHEN V(SYS_DERATE)=1
.meas tran SYS_SHDN_TIME WHEN V(SYS_SHDN)=1
.meas tran SYS_FAULT_TIME WHEN V(SYS_FAULT)=1
.meas tran THERM_STRESS_MAX MAX V(THERM_STRESS) FROM 10 TO 2100
.meas tran THERM_STRESS_AVG AVG V(THERM_STRESS) FROM 10 TO 2100
.meas tran AGE_STRESS_MAX MAX V(AGE_STRESS) FROM 10 TO 2100
.meas tran AGE_STRESS_AVG AVG V(AGE_STRESS) FROM 10 TO 2100
.meas tran COMBINED_STRESS_MAX MAX V(COMBINED_STRESS) FROM 10 TO 2100
.meas tran COMBINED_STRESS_AVG AVG V(COMBINED_STRESS) FROM 10 TO 2100
.meas tran CHG_CMD_SCALE_ADV_MIN MIN V(CHG_CMD_SCALE_ADV) FROM 10 TO 2100
.meas tran CHG_CMD_SCALE_ADV_AVG AVG V(CHG_CMD_SCALE_ADV) FROM 10 TO 2100
.meas tran RISK_SCORE_MAX MAX V(RISK_SCORE) FROM 10 TO 2100
.meas tran RISK_SCORE_AVG AVG V(RISK_SCORE) FROM 10 TO 2100
.meas tran HEALTH_SCORE_MIN MIN V(HEALTH_SCORE) FROM 10 TO 2100
.meas tran HEALTH_SCORE_AVG AVG V(HEALTH_SCORE) FROM 10 TO 2100
.meas tran RISK_WARN_TIME WHEN V(RISK_WARN)=1
.meas tran RISK_CRIT_TIME WHEN V(RISK_CRIT)=1
.meas tran I_HIGH_SAT_TIME WHEN V(I_HIGH_SAT)=1
.meas tran I_LOW_SAT_TIME WHEN V(I_LOW_SAT)=1
.meas tran I_SAT_FLAG_TIME WHEN V(I_SAT_FLAG)=1
.meas tran V_LOW_FAULT_TIME WHEN V(V_LOW_FAULT)=1
.meas tran V_HIGH_FAULT_TIME WHEN V(V_HIGH_FAULT)=1
.meas tran V_RANGE_FAULT_TIME WHEN V(V_RANGE_FAULT)=1
.meas tran SENSOR_FAULT_TIME WHEN V(SENSOR_FAULT)=1
.meas tran MEAS_TRUST_FAIL_TIME WHEN V(MEAS_TRUST_OK)=0
.param V_SENSE_LOW_TH=3.0
.param V_SENSE_HIGH_TH=4.3
.param I_SENSE_HIGH_TH=4.8
.param I_SENSE_LOW_TH=0.1
.model SWADC SW(Ron=10 Roff=1Meg Vt=0.5 Vh=0.1)
.meas tran V_ADC_MAX MAX V(V_ADC_IN) FROM 10 TO 2100
.meas tran V_ADC_AVG AVG V(V_ADC_IN) FROM 10 TO 2100
.meas tran I_ADC_MAX MAX V(I_ADC_IN) FROM 10 TO 2100
.meas tran I_ADC_AVG AVG V(I_ADC_IN) FROM 10 TO 2100
.meas tran T_ADC_MAX MAX V(T_ADC_IN) FROM 10 TO 2100
.meas tran T_ADC_AVG AVG V(T_ADC_IN) FROM 10 TO 2100
.param ADC_BITS=8
.param ADC_LEVELS=255
.param V_ADC_FS=5
.param I_ADC_FS=5
.param T_ADC_FS=100
.meas tran I_ADC_Q_MAX MAX V(I_ADC_Q) FROM 10 TO 2100
.meas tran I_ADC_Q_AVG AVG V(I_ADC_Q) FROM 10 TO 2100
.meas tran T_ADC_Q_MAX MAX V(T_ADC_Q) FROM 10 TO 2100
.meas tran T_ADC_Q_AVG AVG V(T_ADC_Q) FROM 10 TO 2100
.meas tran I_ADC_CODE_MAX MAX V(I_ADC_CODE) FROM 10 TO 2100
.meas tran I_ADC_CODE_AVG AVG V(I_ADC_CODE) FROM 10 TO 2100
.meas tran T_ADC_CODE_MAX MAX V(T_ADC_CODE) FROM 10 TO 2100
.meas tran T_ADC_CODE_AVG AVG V(T_ADC_CODE) FROM 10 TO 2100
.meas tran I_ADC_OUT_MAX MAX V(I_ADC_OUT) FROM 1m TO 20m
.meas tran I_ADC_OUT_AVG AVG V(I_ADC_OUT) FROM 1m TO 20m
.meas tran T_ADC_OUT_MAX MAX V(T_ADC_OUT) FROM 1m TO 20m
.meas tran T_ADC_OUT_AVG AVG V(T_ADC_OUT) FROM 1m TO 20m
.meas tran IADC_D7_AVG AVG V(IADC_D7) FROM 1m TO 20m
.meas tran IADC_D6_AVG AVG V(IADC_D6) FROM 1m TO 20m
.meas tran IADC_D5_AVG AVG V(IADC_D5) FROM 1m TO 20m
.meas tran IADC_D4_AVG AVG V(IADC_D4) FROM 1m TO 20m
.meas tran IADC_D3_AVG AVG V(IADC_D3) FROM 1m TO 20m
.meas tran IADC_D2_AVG AVG V(IADC_D2) FROM 1m TO 20m
.meas tran IADC_D1_AVG AVG V(IADC_D1) FROM 1m TO 20m
.meas tran IADC_D0_AVG AVG V(IADC_D0) FROM 1m TO 20m
.meas tran TADC_D7_AVG AVG V(TADC_D7) FROM 1m TO 20m
.meas tran TADC_D6_AVG AVG V(TADC_D6) FROM 1m TO 20m
.meas tran TADC_D5_AVG AVG V(TADC_D5) FROM 1m TO 20m
.meas tran TADC_D4_AVG AVG V(TADC_D4) FROM 1m TO 20m
.meas tran TADC_D3_AVG AVG V(TADC_D3) FROM 1m TO 20m
.meas tran TADC_D2_AVG AVG V(TADC_D2) FROM 1m TO 20m
.meas tran TADC_D1_AVG AVG V(TADC_D1) FROM 1m TO 20m
.meas tran TADC_D0_AVG AVG V(TADC_D0) FROM 1m TO 20m
.ic V(VSARV_D0_H)=0 V(VSARV_D1_H)=0 V(VSARV_D2_H)=0 V(VSARV_D3_H)=0 V(VSARV_D4_H)=0 V(VSARV_D5_H)=0 V(VSARV_D6_H)=0 V(VSARV_D7_H)=0
* .tran 0 20m 0 2u uic
.meas tran CODEV_1 FIND V(VSAR_CODE_V) WHEN V(ADC_VALID_SAR)=0.5 RISE=1
.meas tran CODEV_2 FIND V(VSAR_CODE_V) WHEN V(ADC_VALID_SAR)=0.5 RISE=2
.meas tran CODEV_3 FIND V(VSAR_CODE_V) WHEN V(ADC_VALID_SAR)=0.5 RISE=3
.meas tran CODEV_4 FIND V(VSAR_CODE_V) WHEN V(ADC_VALID_SAR)=0.5 RISE=4
.meas tran DACV_1 FIND V(DAC_OUT_SAR) WHEN V(ADC_VALID_SAR)=0.5 RISE=1
.meas tran DACV_2 FIND V(DAC_OUT_SAR) WHEN V(ADC_VALID_SAR)=0.5 RISE=2
.meas tran DACV_3 FIND V(DAC_OUT_SAR) WHEN V(ADC_VALID_SAR)=0.5 RISE=3
.meas tran DACV_4 FIND V(DAC_OUT_SAR) WHEN V(ADC_VALID_SAR)=0.5 RISE=4
.meas tran VINV_1 FIND V(V_SAMP_HOLD) WHEN V(ADC_VALID_SAR)=0.5 RISE=1
.meas tran VINV_2 FIND V(V_SAMP_HOLD) WHEN V(ADC_VALID_SAR)=0.5 RISE=2
.meas tran VINV_3 FIND V(V_SAMP_HOLD) WHEN V(ADC_VALID_SAR)=0.5 RISE=3
.meas tran VINV_4 FIND V(V_SAMP_HOLD) WHEN V(ADC_VALID_SAR)=0.5 RISE=4
.model SWSAR SW(Ron=10 Roff=1T Vt=0.5 Vh=0.1)
.lib UniversalOpAmp2.lib
.backanno
.end